# EAGLE design blinky_Ahoura (EAGLE 8.2.2)
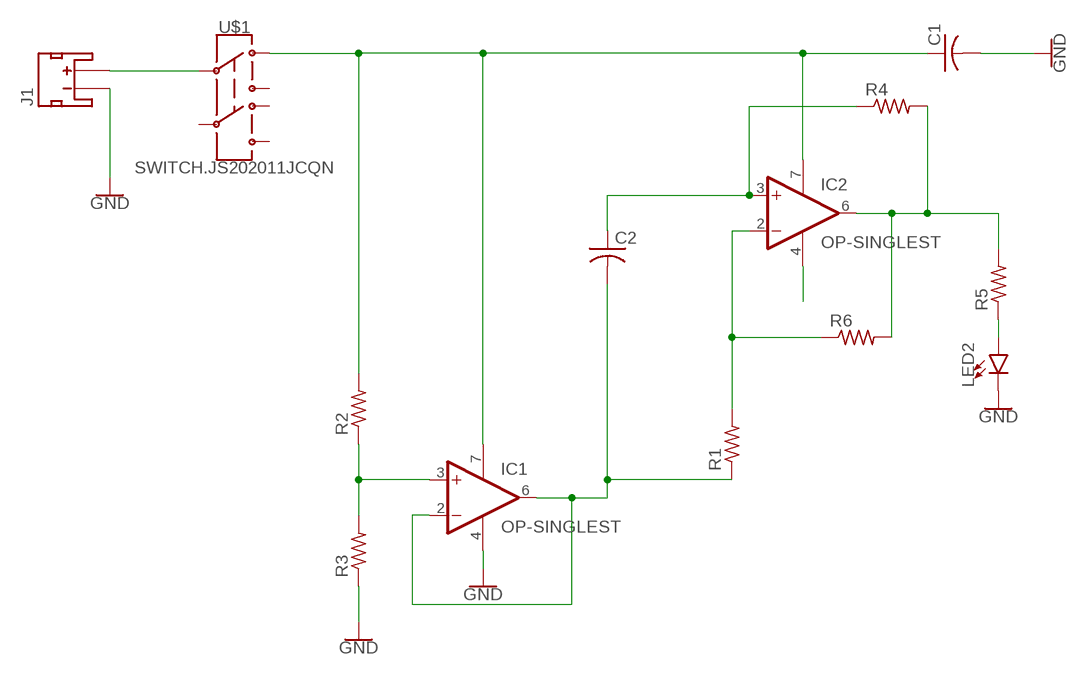
[diagram p0: schematic, sheet 1]

## Parts
C1  C-USC0402  [C0402]
C2  C-USC0402  [C0402]
IC1  OP-SINGLEST  [TSSOP8]
IC2  OP-SINGLEST  [TSSOP8]
J1  JST_2MM_MALE  [JST-2-SMD]
LED2  LED0603  [LED-0603]
R1  R-US_R0402  [R0402]
R2  R-US_R0402  [R0402]
R3  R-US_R0402  [R0402]
R4  R-US_R0402  [R0402]
R5  R-US_R0402  [R0402]
R6  R-US_R0402  [R0402]
U$1  SWITCH.JS202011JCQN  [SWITCH.00]

## Nets
GND: C1.2 IC1.4(V-) J1.1(-) LED2.C R3.1
N$1: J1.2(+) U$1.2
N$2: LED2.A R5.1
N$3: C1.1 IC1.7(V+) IC2.7(V+) R2.2 U$1.1
N$4: IC1.3(+IN) R2.1 R3.2
N$7: C2.2 IC1.2(-IN) IC1.6(OUT) R1.1
N$8: C2.1 IC2.3(+IN) R4.1
N$9: IC2.6(OUT) R4.2 R5.2 R6.2
N$12: IC2.2(-IN) R1.2 R6.1
N$13: IC2.4(V-)
Unconnected: J1.NC1(PAD1) J1.NC2(PAD2) U$1.3 U$1.5 U$1.6 U$1.7

## Library data of the parts
C1 C2 = adafruit:C-US: CAPACITOR, American symbol
IC1 IC2 = CalvEngIO-AnalogIC:OP-SINGLE: Single Op Amp 2.7V to 6.0V Single Supply CMOS Source: http://ww1.microchip.com/downloads/en/DeviceDoc/21314g.pdf
J1 = CalvEngIO-Connectors:JST_2MM_MALE: JST 2MM MALE RA CONNECTOR Two pin, compact surface mount connector. Commonly used as a battery input connection point. We really like the solid locking feeling and high current rating on these small connectors. We use these all the time as battery connectors. Mates to single-cell LiPo batteries. Here is the connector we sell at SparkFun: JST Right Angle Connector - White <https://www.sparkfun.com/products/8612> (PRT-08612) Datasheet <http://www.sparkfun.com/datasheets/Prototyping/Connectors/JST-Horizontal.pdf> It was used on these SparkFun products: SparkFun MOSFET Power Controller <https://www.sparkfun.com/products/11214> (PRT-11214) SparkFun Battery Babysitter - LiPo Battery Manager <https://www.sparkfun.com/products/13777> (PRT-13777) And many, many others that required a lipo battery connection.; PROD_ID: CONN-11443; SF_ID: PRT-08612
LED2 = CalvEngIO-LED:LED: LED (Generic) Standard schematic elements and footprints for 5mm, 3mm, 1206, and 0603 sized LEDs. Generic LEDs with no color specified. LTST-C190KGKT: arrow indicates cathode
R1-R6 = resistor:R-US_: RESISTOR, American symbol
U$1 = CalvEngIO-Switches:SWITCH.JS202011JCQN

## Board
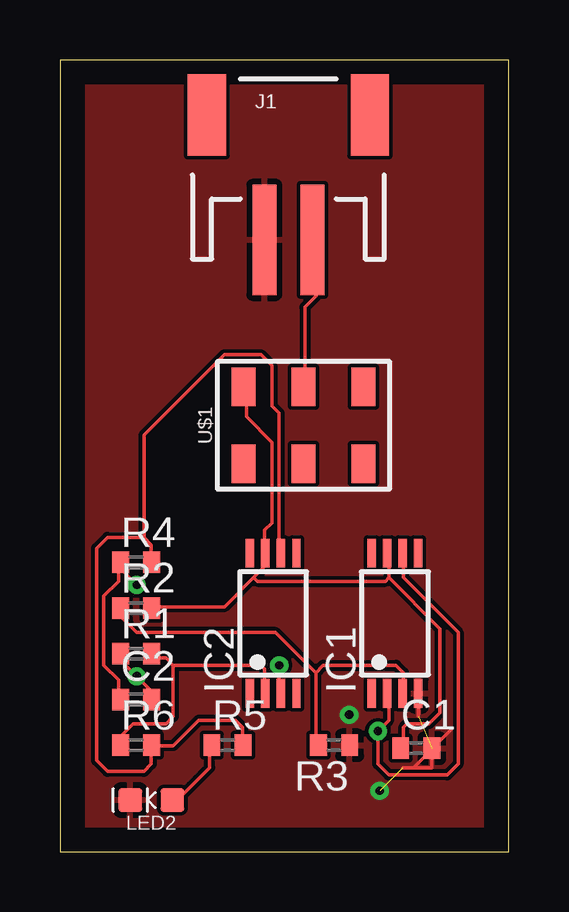
[diagram p1: board, top side]
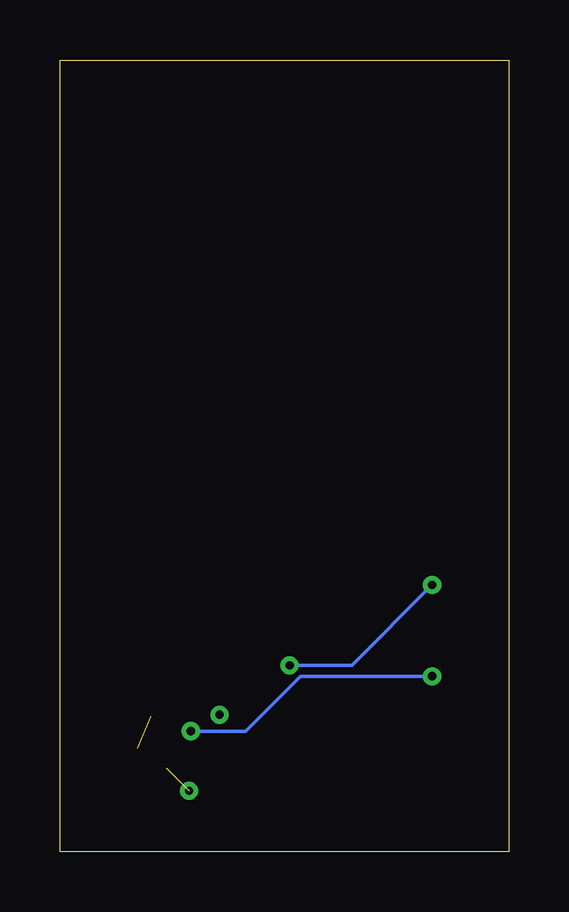
[diagram p2: board, bottom side, seen from below]

Size 18.72 x 33.01 mm. Coordinates in mm from the lower left corner, seen from the top.
Outline: 0,0 18.72,0 18.72,33.01 0,33.01 0,0
Copper layers (1*16): Top 0.035mm / dielectric 1.5mm / Bottom 0.035mm
Design rules "default": minimum track width 6mil, minimum drill 0.35mm, track to track 6mil, track to pad 6mil, pad to pad 6mil, via to via 6mil, smd to smd 6mil, copper to edge 40mil, drill to drill 6mil, minimum pad ring 10mil, minimum via ring 8mil, stop-mask expansion 4mil, vias tented up to drill 0mil, thermal gap 10mil

### Footprints (pad centres in the part's own frame; a part is rotated, then mirrored left to right if it is on the bottom)
C0402 = smd 0.7 x 0.9: 1 -0.65,0; 2 0.65,0
TSSOP8 = smd 0.35 x 1.2: 1 -0.975,-2.925; 2 -0.325,-2.925; 3 0.325,-2.925; 4 0.975,-2.925; 5 0.975,2.925; 6 0.325,2.925; 7 -0.325,2.925; 8 -0.975,2.925
JST-2-SMD = smd 1 x 4.6: 1 -1,-3.7; 2 1,-3.7 | smd 1.6 x 3.4: NC1 -3.4,1.5; NC2 3.4,1.5
LED-0603 = smd 1 x 1: A -0.877,0; C 0.877,0
R0402 = smd 0.7 x 0.9: 1 -0.65,0; 2 0.65,0
SWITCH.00 = smd 1 x 1.6: 1 -2.5,1.6; 2 0,1.6; 3 2.5,1.6; 5 -2.5,-1.6; 6 0,-1.6; 7 2.5,-1.6

### Placement (x,y rotation side)
C1  14.86,4.32 0 top
C2  3.17,6.35 0 top
IC1  13.97,9.53 0 top
IC2  8.89,9.53 0 top
J1  9.53,29.21 0 top
LED2  3.81,2.16 180 top
R1  3.17,8.26 0 top
R2  3.17,10.16 0 top
R3  11.43,4.45 180 top
R4  3.17,12.06 0 top
R5  6.99,4.45 0 top
R6  3.17,4.45 0 top
U$1  10.16,17.78 0 top

### Tracks (layer width: path | path; a pad name or v marks a point on that pad's centre or on a via)
GND  (via drill 0.35)  (2 unrouted)
  Top 0.152: C1.2 15.51,3.5 14.3,3.5 14.73,3.5 16.31,5.08 | IC1.4 14.95,5.64
  other vias: 13.34,2.54 12.06,5.71
  pour Top: -0.64,33.02 -0.64,-0.64 19.68,-0.64 19.68,33.66 -0.64,33.66
  pour Top: -0.64,33.66 -0.64,-1.27 19.68,-1.27 19.68,33.66
  pour Top: -0.64,33.66 -0.64,-0.64 19.05,-0.64 19.05,33.66
N$1
  Top 0.152: U$1.2 10.21,19.51 10.21,22.71 10.67,23.16 10.67,25.45 J1.2
N$2
  Top 0.152: R5.1 6.25,4.42 6.25,3.5 5.03,2.29 4.72,2.29 LED2.A
N$3
  Top 0.152: 13.72,11.43 15.85,9.3 15.85,5.79 15.39,5.33 14.48,5.33 14.33,5.18 14.33,4.42 C1.1 | 13.72,11.43 13.72,12.34 IC1.7 | 8.08,11.43 8.53,11.89 8.53,12.34 IC2.7 8.53,12.5 8.53,13.41 8.84,13.72 8.84,17.07 7.77,18.14 7.77,19.36 U$1.1 | 8.08,11.43 6.86,10.21 3.96,10.21 R2.2 | 13.72,11.43 13.56,11.28 8.23,11.28 8.08,11.43
N$4
  Top 0.152: 10.67,7.47 8.99,9.14 3.2,9.14 2.59,9.75 2.59,10.06 R2.1 | 10.67,7.47 10.67,4.57 R3.2 | 10.67,7.47 10.97,7.77 14.02,7.77 14.33,7.47 14.33,6.71 IC1.3
N$7  (via drill 0.35)
  Top 0.152: R1.1 2.59,8.23 2.59,7.92 v3.2,7.32 3.81,6.71 3.81,6.4 C2.2 | IC1.2 13.72,6.55 13.72,5.49 v13.26,5.03 13.26,3.66 13.72,3.2 16.15,3.2 16.61,3.66 16.61,9.14 14.33,11.43 14.33,12.34 IC1.6
  Bottom 0.152: v3.2,7.32 8.69,7.32 10.97,5.03 v13.26,5.03
N$8  (via drill 0.35)
  Top 0.152: 2.44,11.89 2.44,12.04 R4.1 2.44,11.89 | 2.44,11.89 2.44,11.28 1.83,10.67 1.83,7.77 2.44,7.16 2.44,6.4 C2.1 | v9.14,7.77 9.14,6.71 IC2.3 | 2.44,11.89 v3.2,11.12
  Bottom 0.152: v9.14,7.77 6.55,7.77 v3.2,11.12
N$9
  Top 0.152: R5.2 7.62,4.57 7.62,5.18 7.32,5.49 5.79,5.49 4.72,4.42 3.96,4.42 R6.2 3.81,4.42 3.81,3.66 3.5,3.35 1.98,3.35 1.52,3.81 1.52,12.65 1.98,13.11 3.5,13.11 | 3.5,13.11 3.81,12.8 3.81,12.19 R4.2 | 3.5,13.11 3.5,17.37 6.86,20.73 8.38,20.73 8.84,20.27 8.84,18.59 9.14,18.29 9.14,12.5 IC2.6
N$12
  Top 0.152: 4.72,7.77 4.72,5.64 4.42,5.33 3.05,5.33 2.59,4.88 2.59,4.57 R6.1 | 4.72,7.77 4.42,8.08 3.96,8.08 3.81,8.23 R1.2 | 4.72,7.77 8.38,7.77 8.53,7.62 8.53,6.71 IC2.2